# EAGLE design w550io (EAGLE 6.5.0)
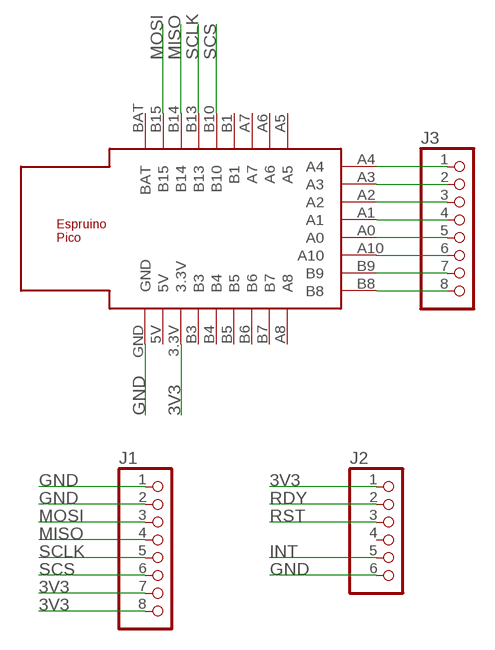
[diagram p0: schematic, sheet 1]

## Parts
J1  PINHD-1X8  [1X08]
J2  PINHD-1X6  [1X06]
J3  PINHD-1X8  [1X08]
U$1  ESPRUINO_PICO_SMD  [ESPRUINO_PICO_SMD]

## Nets
3V3: J1.7 J1.8 J2.1 U$1.3.3V
GND: J1.1 J1.2 J2.6 U$1.GND
INT: J2.5
MISO: J1.4 U$1.B14
MOSI: J1.3 U$1.B15
N$1: J3.1 U$1.A4
N$2: J3.2 U$1.A3
N$3: J3.3 U$1.A2
N$4: J3.4 U$1.A1
N$5: J3.5 U$1.A0
N$6: J3.6 U$1.A10
N$7: J3.7 U$1.B9
N$8: J3.8 U$1.B8
RDY: J2.2
RST: J2.3
SCLK: J1.5 U$1.B13
SCS: J1.6 U$1.B10
Unconnected: J2.4 U$1.5V U$1.A5 U$1.A6 U$1.A7 U$1.A8 U$1.B1 U$1.B3 U$1.B4 U$1.B5 U$1.B6 U$1.B7 U$1.BAT

## Library data of the parts
J1 J3 = pinhead:PINHD-1X8: PIN HEADER
J2 = pinhead:PINHD-1X6: PIN HEADER
U$1 = espruino_pico:ESPRUINO_PICO_SMD

## Net classes
0 default: width 0.305 mm

## Board
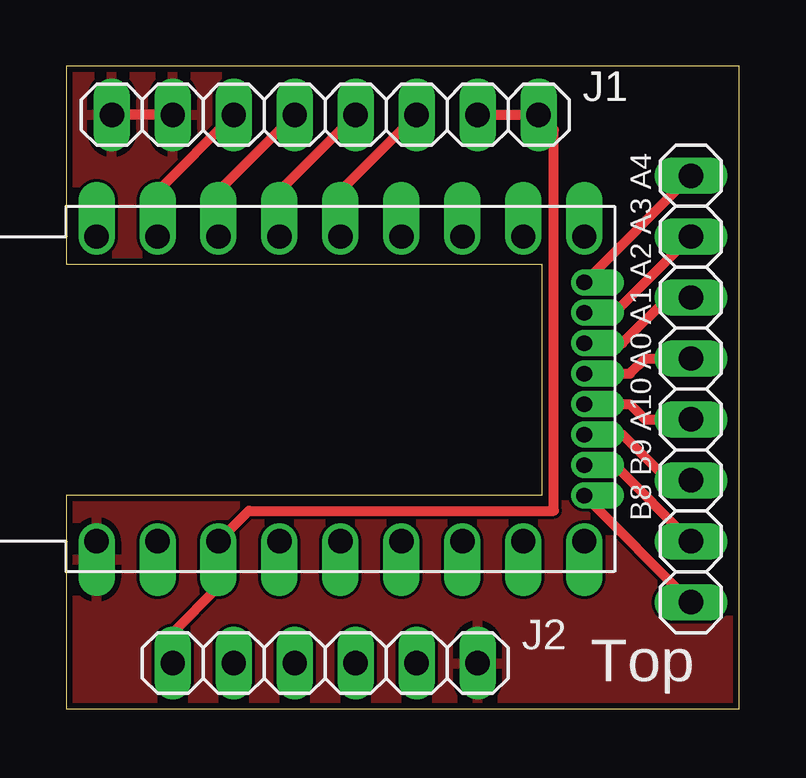
[diagram p1: board, top side]
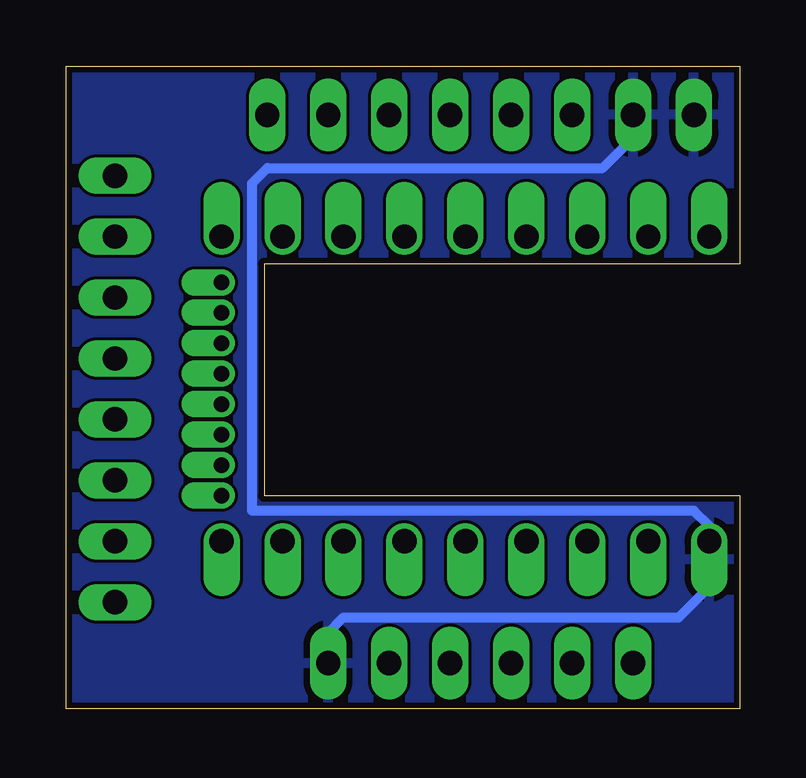
[diagram p2: board, bottom side, seen from below]

Size 28.05 x 26.79 mm. Coordinates in mm from the lower left corner, seen from the top.
Outline: 0,0 28.05,0 28.05,26.79 0,26.79 0,18.54 19.81,18.54 19.81,8.89 0,8.89 0,0
Copper layers (1*16): Top 0.035mm / dielectric 1.5mm / Bottom 0.035mm
Design rules "dirt_cheap_dirty_boards.v1 *": minimum track width 5mil, minimum drill 12mil, track to track 5mil, track to pad 5mil, pad to pad 5mil, via to via 5mil, smd to smd 0mil, copper to edge 10mil, drill to drill 10mil, minimum pad ring 9mil, minimum via ring 6mil, stop-mask expansion 2mil, vias tented up to drill 25mil, thermal gap 10mil

### Footprints (pad centres in the part's own frame; a part is rotated, then mirrored left to right if it is on the bottom)
1X08 = drill 1.016 long: 1 -8.89,0; 2 -6.35,0; 3 -3.81,0; 4 -1.27,0; 5 1.27,0; 6 3.81,0; 7 6.35,0; 8 8.89,0
1X06 = drill 1.016 long: 1 -6.35,0; 2 -3.81,0; 3 -1.27,0; 4 1.27,0; 5 3.81,0; 6 6.35,0
ESPRUINO_PICO_SMD = drill 1.016 offset: 3.3V -8.89,-6.35; 5V -11.43,-6.35; A5 6.35,6.35; A6 3.81,6.35; A7 1.27,6.35; A8 6.35,-6.35; B1 -1.27,6.35; B3 -6.35,-6.35; B4 -3.81,-6.35; B5 -1.27,-6.35; B6 1.27,-6.35; B7 3.81,-6.35; B10 -3.81,6.35; B13 -6.35,6.35; B14 -8.89,6.35; B15 -11.43,6.35; BAT -13.97,6.35; GND -13.97,-6.35 | drill 0.65 pad 0.965 offset: A0 6.35,-0.635; A1 6.35,0.635; A2 6.35,1.905; A3 6.35,3.175; A4 6.35,4.445; A10 6.35,-1.905; B8 6.35,-4.445; B9 6.35,-3.175

### Placement (x,y rotation side)
J1  10.79,24.77 0 top
J2  10.79,1.91 0 top
J3  26.04,13.34 270 top
U$1  15.24,13.34 0 top

### Tracks (layer width: path | path; a pad name or v marks a point on that pad's centre or on a via)
3V3
  Top 0.406: J1.7 J1.8 20.32,24.13 20.32,8.26 7.62,8.26 U$1.3.3V 6.35,5.08 4.45,3.17 J2.1
GND
  Top 0.406: J1.2 J1.1
  Bottom 0.406: J2.6 17.14,3.17 16.51,3.81 2.54,3.81 1.27,5.08 U$1.GND 1.27,7.62 1.91,8.26 20.32,8.26 20.32,21.91 19.68,22.54 5.71,22.54 4.45,23.81 J1.2
  pour Bottom: -1.27,27.94 29.21,27.94 29.21,-1.27 -1.27,-1.27
  pour Top: -1.27,27.94 29.21,27.94 29.21,-1.27 -1.27,-1.27
MISO
  Top 0.406: U$1.B14 6.35,21.59 J1.4
MOSI
  Top 0.406: U$1.B15 3.81,21.59 J1.3
N$1
  Top 0.406: J3.1 U$1.A4
N$2
  Top 0.406: U$1.A3 22.86,16.51 J3.2
N$3
  Top 0.406: U$1.A2 23.18,15.24 25.08,17.14 J3.3
N$4
  Top 0.406: U$1.A1 23.5,13.97 24.13,14.61 J3.4
N$5
  Top 0.406: U$1.A0 23.5,12.7 24.13,12.06 J3.5
N$6
  Top 0.406: U$1.A10 23.18,11.43 25.08,9.53 J3.6
N$7
  Top 0.406: U$1.B9 22.86,10.16 J3.7
N$8
  Top 0.406: U$1.B8 J3.8
SCLK
  Top 0.406: U$1.B13 8.89,21.59 J1.5
SCS
  Top 0.406: U$1.B10 11.43,21.59 J1.6

### Text on the board
tPlace: B8 B9 A10 A0 A1 A2 A3 A4
tNames: Top